# EAGLE design volume board MUSE (EAGLE 6.3)
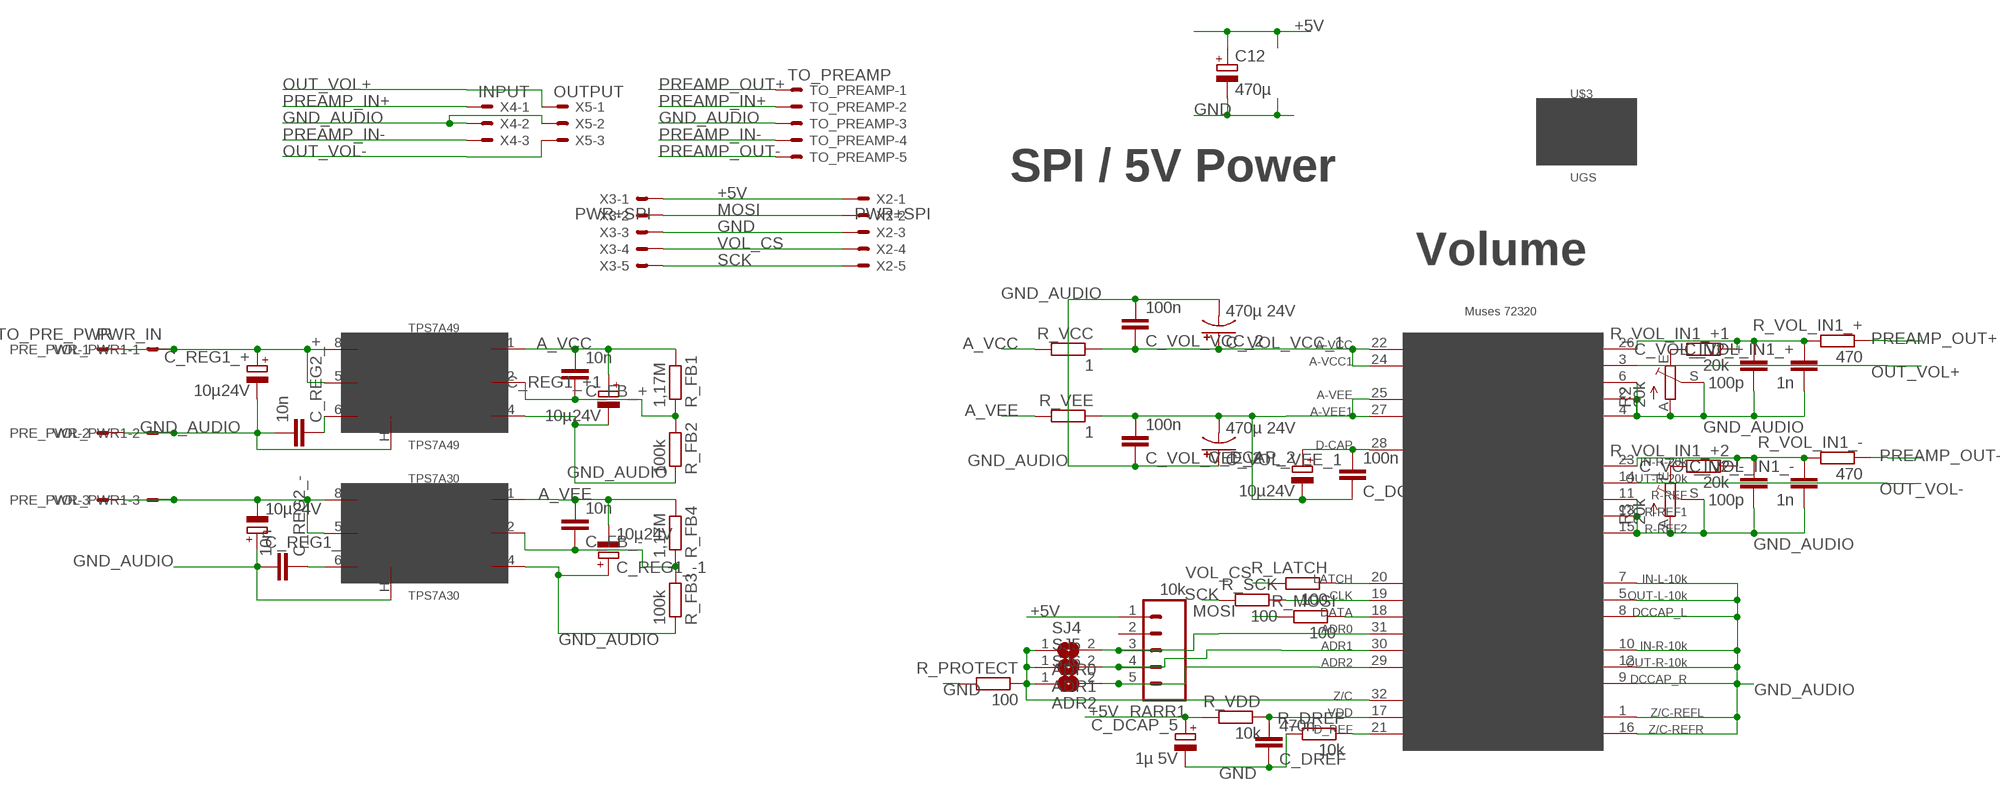
[diagram p0: schematic, sheet 1]

## Parts
C12  470µ  CPOL-EUE2.5-6  [E2,5-6]
C_DCAP_1  100n  C-EUC0603  [C0603]
C_DCAP_2  10µ24V  CPOL-EUC  [PANASONIC_C]
C_DCAP_5  1µ 5V  CPOL-EUE1.8-4  [E1,8-4]
C_DREF  470n  C-EU075-042X103  [C075-042X103]
C_FB_+  10n  C-EUC0603  [C0603]
C_FB_-  10n  C-EUC0603  [C0603]
C_REG1_+  10µ24V  CPOL-EUC  [PANASONIC_C]
C_REG1_+1  10µ24V  CPOL-EUC  [PANASONIC_C]
C_REG1_-  10µ24V  CPOL-EUC  [PANASONIC_C]
C_REG1_-1  10µ24V  CPOL-EUC  [PANASONIC_C]
C_REG2_+  10n  C-EUC0603  [C0603]
C_REG2_-  10n  C-EUC0603  [C0603]
C_VOL_IN1_+  1n  C-EU102-043X133  [C102-043X133]
C_VOL_IN1_-  1n  C-EU102-043X133  [C102-043X133]
C_VOL_IN2_+  100p  C-EU075-032X103  [C075-032X103]
C_VOL_IN2_-  100p  C-EU075-032X103  [C075-032X103]
C_VOL_VCC_1  470µ 24V  CAP_POLH13  [PANASONIC_H13]
C_VOL_VCC_2  100n  C-EUC0603  [C0603]
C_VOL_VEE_1  470µ 24V  CAP_POLH13  [PANASONIC_H13]
C_VOL_VEE_2  100n  C-EUC0603  [C0603]
PRE_PWR  TO_PRE_PWR  C-GRID-03-70543  [70543-03]
R2  20k  TRIM_EU-RJ9W  [RJ9W]
R3  20k  TRIM_EU-RJ9W  [RJ9W]
R_DREF  10k  R-EU_0207/7  [0207/7]
R_FB1  1,17M  R-EU_0207/7  [0207/7]
R_FB2  100k  R-EU_0207/7  [0207/7]
R_FB3  100k  R-EU_0207/7  [0207/7]
R_FB4  1,17M  R-EU_0207/7  [0207/7]
R_LATCH  100  R-EU_0207/7  [0207/7]
R_MOSI  100  R-EU_0207/7  [0207/7]
R_PROTECT  100  R-EU_0207/7  [0207/7]
R_SCK  100  R-EU_0207/7  [0207/7]
R_VCC  1  R-EU_0207/7  [0207/7]
R_VDD  10k  R-EU_0207/7  [0207/7]
R_VEE  1  R-EU_0207/7  [0207/7]
R_VOL_IN1_+  470  R-EU_0207/10  [0207/10]
R_VOL_IN1_+1  20k  R-EU_0207/7  [0207/7]
R_VOL_IN1_+2  20k  R-EU_0207/7  [0207/7]
R_VOL_IN1_-  470  R-EU_0207/10  [0207/10]
RARR1  10k  M05PTH  [1X05]
SJ4  ADR0  SJ  [SJ]
SJ5  ADR1  SJ  [SJ]
SJ6  ADR2  SJ  [SJ]
TO_PREAMP  TO_PREAMP  C-GRID-05-70543  [70543-05]
TPS7A30  TPS7A30  TPS7A49+36V150MA_REG  [MSOP8]
TPS7A49  TPS7A49  TPS7A49+36V150MA_REG  [MSOP8]
U$1  MUSES72320  [SSOP32]
U$3  UGS  [UGS]
VOL_PWR1  PWR_IN  C-GRID-03-70543  [70543-03]
X2  PWR+SPI  C-GRID-05-70543  [70543-05]
X3  PWR+SPI  C-GRID-05-70543  [70543-05]
X4  INPUT  C-GRID-03-70543  [70543-03]
X5  OUTPUT  C-GRID-03-70543  [70543-03]

## Nets
+5V [power]: C12.+ C_DCAP_5.+ R_VDD.2 RARR1.1 X2.1 X3.1
A_VCC [power]: C_FB_+.2 C_REG1_+1.+ R_FB1.2 R_VCC.2 TPS7A49.1(OUT)
A_VEE [power]: C_FB_-.2 C_REG1_-1.- R_FB4.2 R_VEE.2 TPS7A30.1(OUT)
GND [power]: C12.- C_DCAP_5.- C_DREF.1 R_DREF.2 R_PROTECT.2 X2.3 X3.3
GND_AUDIO [power]: C_REG1_+1.- C_REG1_+.- C_REG1_-1.+ C_REG1_-.+ C_REG2_+.2 C_REG2_-.2 C_VOL_IN1_+.2 C_VOL_IN1_-.2 C_VOL_IN2_+.2 C_VOL_IN2_-.2 C_VOL_VCC_1.- C_VOL_VCC_2.2 C_VOL_VEE_1.+ C_VOL_VEE_2.1 PRE_PWR.2 R2.A R2.S R3.A R3.S R_FB2.1 R_FB3.1 TO_PREAMP.3 TPS7A30.4(GND) TPS7A30.H TPS7A49.4(GND) TPS7A49.H U$1.1 U$1.2 U$1.4 U$1.5 U$1.6 U$1.7 U$1.8 U$1.9 U$1.10 U$1.11 U$1.12 U$1.13 U$1.15 U$1.16 VOL_PWR1.2 X4.2 X5.2
JHGCD: R_PROTECT.1 SJ4.1 SJ5.1 SJ6.1 U$1.32
MOSI: R_MOSI.2 X2.2 X3.2
N$1: RARR1.3 SJ4.2 U$1.31
N$2: RARR1.5 SJ6.2 U$1.29
N$5 [power]: C_REG1_-.- PRE_PWR.3 TPS7A30.5(EN) TPS7A30.8(IN) VOL_PWR1.3
N$19: C_VOL_IN1_+.1 C_VOL_IN2_+.1 R_VOL_IN1_+1.1 R_VOL_IN1_+.2 U$1.26
N$27 [power]: C_REG1_+.+ PRE_PWR.1 TPS7A49.5(EN) TPS7A49.8(IN) VOL_PWR1.1
N$37: C_VOL_IN1_-.1 C_VOL_IN2_-.1 R_VOL_IN1_+2.1 R_VOL_IN1_-.2 U$1.23
N$38: R2.E R_VOL_IN1_+1.2
N$39: R3.E R_VOL_IN1_+2.2
N$41 [power]: C_VOL_VCC_1.+ C_VOL_VCC_2.1 R_VCC.1 U$1.22 U$1.24
N$44 [power]: C_DCAP_1.1 C_DCAP_2.- C_VOL_VEE_1.- C_VOL_VEE_2.2 R_VEE.1 U$1.25 U$1.27
N$45: C_DCAP_1.2 C_DCAP_2.+ U$1.28
N$46: R_LATCH.1 U$1.20
N$47: R_SCK.1 U$1.19
N$48: R_MOSI.1 U$1.18
N$50: RARR1.4 SJ5.2 U$1.30
N$53: C_DREF.2 R_VDD.1 U$1.17
N$54: R_DREF.1 U$1.21
N$57: C_FB_+.1 R_FB1.1 R_FB2.2 TPS7A49.2(FB)
N$60: C_FB_-.1 R_FB3.2 R_FB4.1 TPS7A30.2(FB)
N$63: C_REG2_-.1 TPS7A30.6(NR/SS)
N$66: C_REG2_+.1 TPS7A49.6(NR/SS)
OUT_VOL+ [power]: U$1.3 X5.1
OUT_VOL- [power]: U$1.14 X5.3
PREAMP_IN+ [power]: TO_PREAMP.2 X4.1
PREAMP_IN- [power]: TO_PREAMP.4 X4.3
PREAMP_OUT+ [power]: R_VOL_IN1_+.1 TO_PREAMP.1
PREAMP_OUT- [power]: R_VOL_IN1_-.1 TO_PREAMP.5
SCK: R_SCK.2 X2.5 X3.5
VOL_CS: R_LATCH.2 X2.4 X3.4
Unconnected: RARR1.2

## Notes on the sheet
- SPI / 5V Power
- Volume

## Library data of the parts
C12 C_DCAP_2 C_DCAP_5 C_REG1_+ C_REG1_+1 C_REG1_- C_REG1_-1 = rcl:CPOL-EU: POLARIZED CAPACITOR, European symbol
C_DCAP_1 C_DREF C_FB_+ C_FB_- C_REG2_+ C_REG2_- C_VOL_IN1_+ C_VOL_IN1_- C_VOL_IN2_+ C_VOL_IN2_- C_VOL_VCC_2 C_VOL_VEE_2 = rcl:C-EU: CAPACITOR, European symbol
C_VOL_VCC_1 C_VOL_VEE_1 = SparkFun:CAP_POL: Capacitor Polarized These are standard SMD and PTH capacitors. Normally 10uF, 47uF, and 100uF in electrolytic and tantalum varieties. Always verify the external diameter of the through hole cap, it varies with capacity, voltage, and manufacturer. The EIA devices should be standard.
PRE_PWR VOL_PWR1 X4 X5 = con-molex:C-GRID-03: CONNECTOR wire to board 2.54 mm (0.100") pitch header; OC_FARNELL: unknown; OC_NEWARK: unknown
R2 R3 = pot:TRIM_EU-: POTENTIOMETER
R_DREF R_FB1-R_FB4 R_LATCH R_MOSI R_PROTECT R_SCK R_VCC R_VDD R_VEE R_VOL_IN1_+ R_VOL_IN1_+1 R_VOL_IN1_+2 R_VOL_IN1_- = rcl:R-EU_: RESISTOR, European symbol
RARR1 = SparkFun:M05: Header 5 Standard 5-pin 0.1" header. Use with straight break away headers (SKU : PRT-00116), right angle break away headers (PRT-00553), swiss pins (PRT-00743), machine pins (PRT-00117), and female headers (PRT-00115). Molex polarized connector foot print use with SKU : PRT-08230 with associated crimp pins and housings.
SJ4-SJ6 = jumper:SJ: SMD solder JUMPER
TO_PREAMP X2 X3 = con-molex:C-GRID-05: CONNECTOR wire to board 2.54 mm (0.100") pitch header; OC_FARNELL: unknown; OC_NEWARK: unknown
TPS7A30 TPS7A49 = gael:TPS7A49+36V150MA_REG
U$1 = gael:MUSES72320
U$3 = gael:UGS

## Net classes
0 default: width 0.203 mm, clearance 0.203 mm
1 mains: width 0.508 mm, clearance 2.5 mm
2 earth: width 1.27 mm, clearance 0.508 mm
3 main2: width 0.508 mm, clearance 1.5 mm
4 power: width 0.381 mm, clearance 0.203 mm

## Board
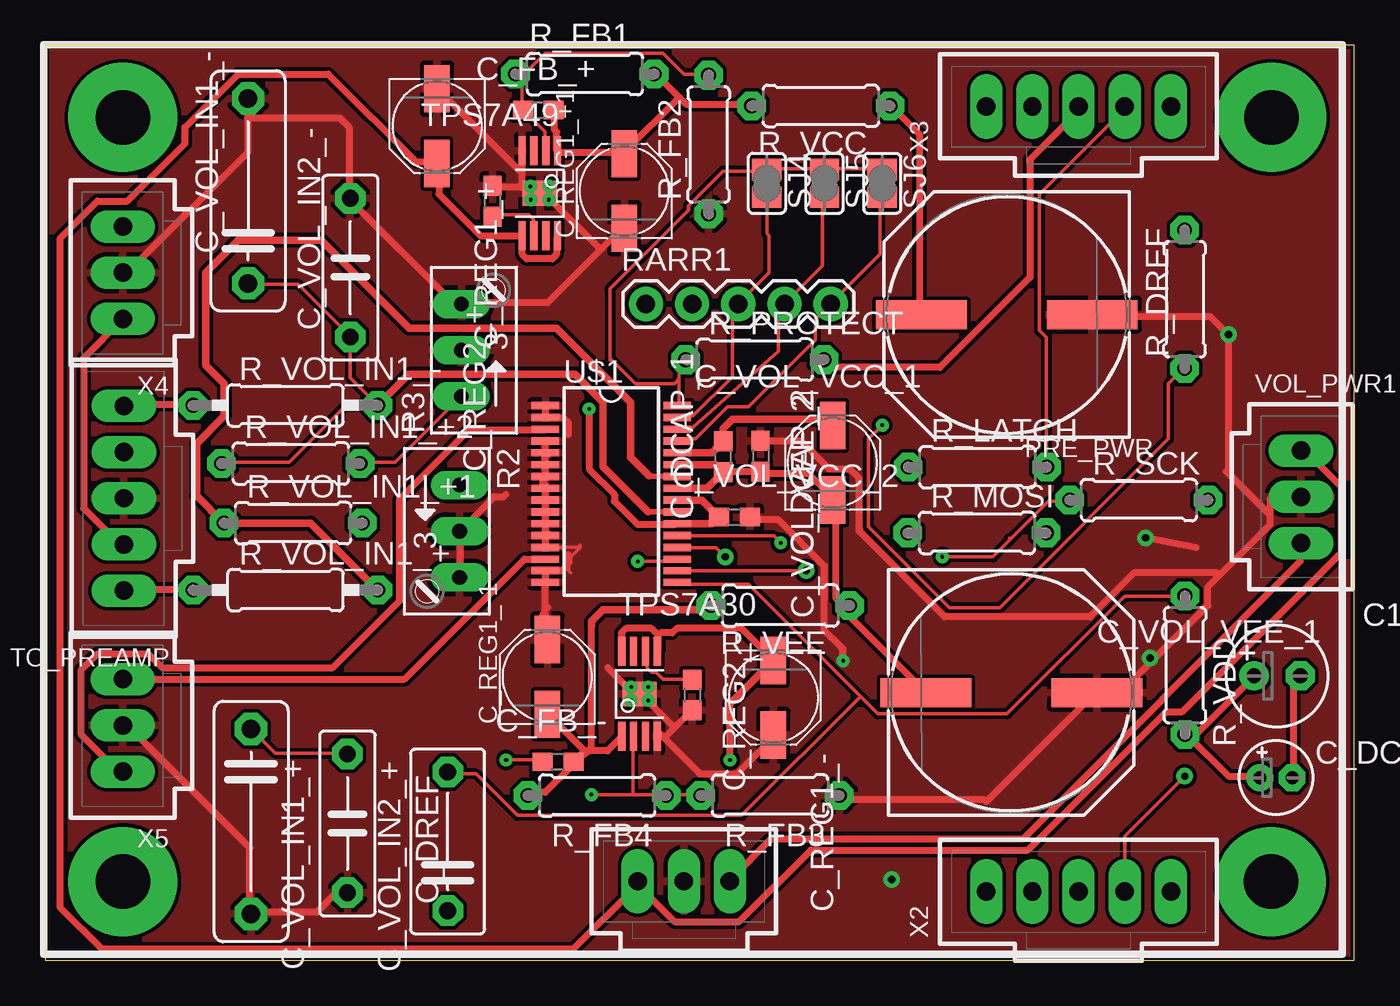
[diagram p1: board, top side]
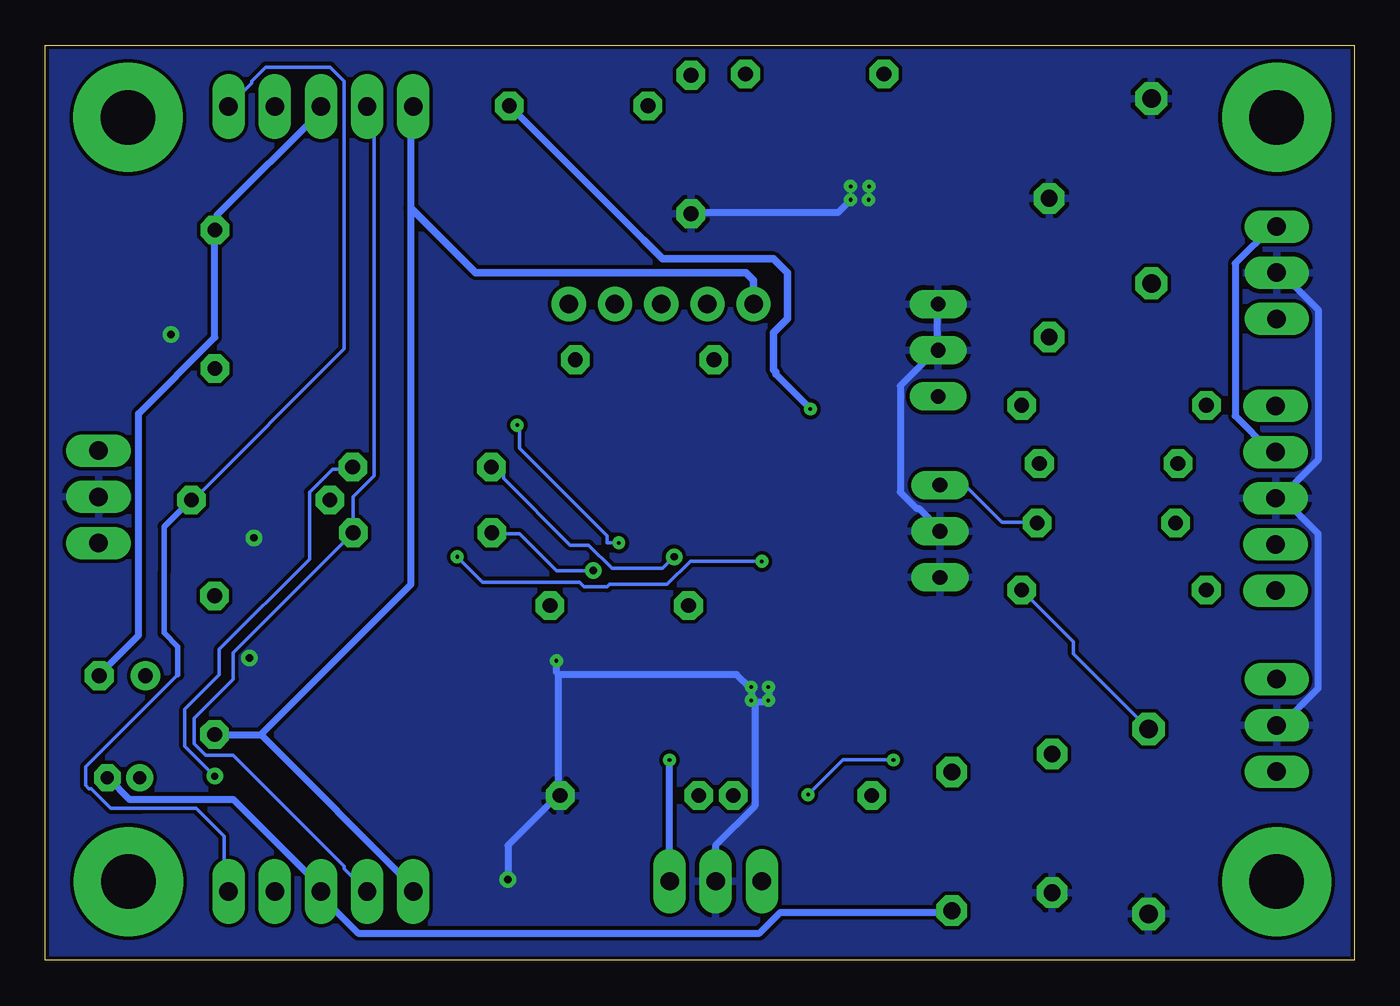
[diagram p2: board, bottom side, seen from below]

Size 71.99 x 50.3 mm. Coordinates in mm from the lower left corner, seen from the top.
Outline: 0,0 71.99,0 71.99,50.3 0,50.3 0,0
Copper layers (1*16): Top 0.035mm / dielectric 1.5mm / Bottom 0.035mm
Design rules "gael design rules": minimum track width 0.2mm, minimum drill 0.2mm, track to track 8mil, track to pad 8mil, pad to pad 8mil, via to via 8mil, smd to smd 8mil, copper to edge 0.2mm, drill to drill 0.2mm, minimum pad ring 15mil, minimum via ring 10mil, stop-mask expansion 4mil, vias tented up to drill 0mil, thermal gap 10mil

### Footprints (pad centres in the part's own frame; a part is rotated, then mirrored left to right if it is on the bottom)
E2,5-6 = drill 0.813 pad 1.6: + -1.27,0 | drill 0.813 pad 1.6 octagon: - 1.27,0
C0603 = smd 1.1 x 1: 1 -0.85,0; 2 0.85,0
PANASONIC_C = smd 2.6 x 1.4: + 2.05,0; - -2.05,0
E1,8-4 = drill 0.711 pad 1.168: + -0.889,0 | drill 0.711 pad 1.168 octagon: - 0.889,0
C075-042X103 = drill 0.914 octagon: 1 -3.81,0; 2 3.81,0
C102-043X133 = drill 1.016 octagon: 1 -5.08,0; 2 5.08,0
C075-032X103 = drill 0.914 octagon: 1 -3.81,0; 2 3.81,0
PANASONIC_H13 = smd 5 x 1.6: + 4.7,0; - -4.7,0
70543-03 = drill 1.016 long: 1 -2.54,0; 2 0,0; 3 2.54,0
RJ9W = drill 0.813 long: A 2.54,0.635; E -2.54,0.635; S 0,0.635
0207/7 = drill 0.813 octagon: 1 -3.81,0; 2 3.81,0
0207/10 = drill 0.813 octagon: 1 -5.08,0; 2 5.08,0
1X05 = drill 1.016 pad 1.88: 1 0,0; 2 2.54,0; 3 5.08,0; 4 7.62,0; 5 10.16,0
SJ = smd 1.168 x 1.6: 1 -0.762,0; 2 0.762,0
70543-05 = drill 1.016 long: 1 -5.08,0; 2 -2.54,0; 3 0,0; 4 2.54,0; 5 5.08,0
MSOP8 = smd 0.4 x 1.6: 1 0.295,-1.065; 2 0.945,-1.065; 3 1.595,-1.065; 4 2.245,-1.065; 5 2.245,3.615; 6 1.595,3.615; 7 0.945,3.615; 8 0.295,3.615 | smd 1.89 x 1.372: H 1.27,1.27
SSOP32 = smd 0.4 x 1.5: 1 0.855,-1.085; 2 1.505,-1.085; 3 2.155,-1.085; 4 2.805,-1.085; 5 3.455,-1.085; 6 4.105,-1.085; 7 4.755,-1.085; 8 5.405,-1.085; 9 6.055,-1.085; 10 6.705,-1.085; 11 7.355,-1.085; 12 8.005,-1.085; 13 8.655,-1.085; 14 9.305,-1.085; 15 9.925,-1.085; 16 10.575,-1.085; 17 10.575,6.165; 18 9.94,6.165; 19 9.305,6.165; 20 8.655,6.165; 21 8.005,6.165; 22 7.355,6.165; 23 6.705,6.165; 24 6.055,6.165; 25 5.405,6.165; 26 4.755,6.165; 27 4.105,6.165; 28 3.455,6.165; 29 2.805,6.165; 30 2.155,6.165; 31 1.505,6.165; 32 0.855,6.165
UGS = drill 3 pad 6: P$1 23.165,-12.497; P$2 23.19,29.54; P$3 -40.005,29.54; P$4 -40.005,-12.497

### Placement (x,y rotation side)
C12  67.76,15.63 0 top
C_DCAP_1  37.29,27.67 90 top
C_DCAP_2  43.3,27.35 90 top
C_DCAP_5  67.69,10.03 0 top
C_DREF  22.13,6.53 90 top
C_FB_+  27.11,46.74 0 top
C_FB_-  28.19,10.9 0 top
C_REG1_+  21.54,45.86 270 top
C_REG1_+1  31.85,42.29 90 top
C_REG1_-  40.04,14.43 270 top
C_REG1_-1  27.61,15.57 90 top
C_REG2_+  24.61,41.72 90 top
C_REG2_-  35.58,14.58 270 top
C_VOL_IN1_+  11.31,7.62 270 top
C_VOL_IN1_-  11.15,42.3 90 top
C_VOL_IN2_+  16.61,7.51 270 top
C_VOL_IN2_-  16.77,38.08 90 top
C_VOL_VCC_1  52.88,35.49 180 top
C_VOL_VCC_2  37.89,24.36 0 top
C_VOL_VEE_1  53.14,14.7 0 top
C_VOL_VEE_2  39.34,27.71 270 top
PRE_PWR  35.12,4.34 0 top
R2  22.14,23.58 270 top
R3  23.51,33.54 90 top
R_DREF  62.67,36.34 90 top
R_FB1  29.67,48.73 0 top
R_FB2  36.48,44.85 90 top
R_FB3  39.86,9.05 180 top
R_FB4  30.34,9.05 180 top
R_LATCH  51.27,27.11 0 top
R_MOSI  51.25,23.5 0 top
R_PROTECT  39.03,33.02 0 top
R_SCK  60.15,25.3 0 top
R_VCC  42.65,46.97 180 top
R_VDD  62.68,16.22 270 top
R_VEE  40.42,19.49 180 top
R_VOL_IN1_+  13.2,20.35 0 top
R_VOL_IN1_+1  13.63,24.03 0 top
R_VOL_IN1_+2  13.5,27.31 0 top
R_VOL_IN1_-  13.2,30.51 0 top
RARR1  33.04,36.08 0 top
SJ4  39.68,42.71 270 top
SJ5  42.86,42.71 270 top
SJ6  46.03,42.71 270 top
TO_PREAMP  4.31,25.4 90 top
TPS7A30  31.41,13.36 0 top
TPS7A49  28.47,43.45 180 top
U$1  28.59,31.35 270 top
U$3  44.26,16.81 0 top
VOL_PWR1  69.07,25.47 270 top
X2  56.83,3.76 0 top
X3  56.83,46.94 0 top
X4  4.25,37.8 90 top
X5  4.25,12.91 90 top

### Tracks (layer width: path | path; a pad name or v marks a point on that pad's centre or on a via)
+5V
  Top 0.381: C_DCAP_5.+ 66.74,10.11 65.09,10.11 62.8,12.4 R_VDD.2 63.18,12.27 66.48,15.58 C12.+
  Bottom 0.381: X2.1 51.75,4.02 60.13,12.4 | 60.13,12.4 62.67,12.4 R_VDD.2 | X3.1 51.88,46.82 51.88,41.36 51.88,36.66 51.88,20.65 60.01,12.53 60.13,12.4
  Bottom 0.406: RARR1.1 33.04,37.37 33.46,37.8 48.32,37.8 51.88,41.36
A_VCC
  Top 0.381: C_FB_+.2 28,46.69 28,45.67 28.13,45.55 28.13,44.53 TPS7A49.1 28.26,44.4 31.81,44.4 C_REG1_+1.+ 31.94,44.53 34.73,47.32 34.86,47.45 | 34.86,47.45 33.59,48.72 R_FB1.2 | 34.86,47.45 35.24,47.07 38.8,47.07 R_VCC.2
A_VEE
  Top 0.381: C_FB_-.2 29.91,11.51 30.92,11.51 31.69,12.27 TPS7A30.1 | C_FB_-.2 29.65,11.51 27.62,13.54 C_REG1_-1.- 27.88,13.04 | 26.48,9.1 R_FB4.2 26.61,9.22 27.5,9.22 29.02,10.75 C_FB_-.2 | 30.04,18.37 30.04,11.64 C_FB_-.2
  Top 0.406: 30.04,18.37 30.04,18.62 30.67,19.26 36.38,19.26 R_VEE.2
  Bottom 0.381: 36.51,19.51 R_VEE.2
GND
  Top 0.381: C_DCAP_5.- 68.64,10.11 68.64,15.19 69.02,15.58 C12.- | X3.3 56.83,46.69 54.17,44.02 54.17,37.55 49.21,32.59 42.86,32.59 42.86,32.72 42.86,32.97 R_PROTECT.2
  Bottom 0.381: X3.3 56.83,46.69 62.55,40.98 62.55,40.21 R_DREF.2 62.67,39.96 62.67,34.24 66.87,30.05 66.87,17.86 69.02,15.7 C12.- | C_DCAP_5.- 68.52,9.99 67.37,8.84 61.66,8.84 56.83,4.02 X2.3 56.96,3.64 54.8,1.48 32.7,1.48 31.56,2.62 22.16,2.62 C_DREF.1
GND_AUDIO  (via drill 0.2, 0.2 pad 0.3, 0.4)
  Top 0.203: U$1.13 29.28,22.69 29.4,22.81 29.4,22.69 28.77,22.05 | 28.77,21.8 28.77,21.42 28.89,21.29 28.64,21.54 28.38,21.54 28.38,21.42
  Top 0.381: 27.5,19 27.5,17.73 C_REG1_-1.+ | 27.5,19 27.5,19.38 | 27.5,19.38 27.5,20.65 U$1.16 27.5,21.42 U$1.15 27.62,21.42 28.38,21.42 | 27.37,19 27.5,19 | U$1.13 27.5,22.81 27.5,23.32 U$1.12 | U$1.12 27.5,23.45 27.5,23.83 U$1.11 27.5,24.08 27.5,24.59 U$1.10 27.5,24.72 27.5,25.23 U$1.9 27.5,25.35 27.5,25.86 U$1.8 27.5,26.12 | U$1.1 27.5,30.43 27.5,29.93 U$1.2 27.62,29.8 28.51,29.8 28.77,29.54 28.77,28.91 | 27.5,26.5 U$1.7 | U$1.7 27.5,26.75 27.5,26.88 27.5,27.13 U$1.6 27.5,27.39 27.5,27.77 U$1.5 | U$1.4 27.5,28.53 27.5,28.02 U$1.5 | 27.62,27.77 U$1.5 | 38.93,24.34 C_VOL_VCC_2.2 39.05,24.21 40.32,24.21 42.86,21.67 42.86,18.11 43.75,17.23 43.88,17.1 v43.88,16.46 | 40.07,12.4 C_REG1_-.+ | 30.92,16.08 32.32,14.69 32.58,14.69 TPS7A30.H | 27.62,19.38 27.5,19.38 | 28.77,22.31 28.77,22.05 28.77,21.8 | 27.62,23.45 U$1.12 | 32.19,14.41 32.19,14.43 32.19,14.56 TPS7A30.H | 33.08,14.94 32.83,14.69 TPS7A30.H | 43.75,9.22 R_FB3.1 43.88,9.1 44.13,8.84 51.63,8.84 51.75,8.72 57.72,14.69 C_VOL_VEE_1.+ 57.98,14.81 59.25,14.81 60.9,16.46 | 67.37,24.59 67.37,23.96 64.58,21.16 | 67.37,24.59 67.37,25.35 VOL_PWR1.2 | 64.58,21.16 63.94,20.53 63.94,19.51 60.9,16.46 | TPS7A49.H 27.11,42.37 TPS7A49.H | X4.2 4.51,37.8 11.11,44.4 11.11,46.31 | 11.11,46.31 11.11,47.32 C_VOL_IN1_-.2 | 11.11,46.31 11.24,46.31 16.19,46.31 16.32,46.18 16.7,45.8 16.7,41.99 C_VOL_IN2_-.2 16.83,41.74 22.29,36.28 R3.A 21.53,36.15 27.62,36.15 30.54,39.07 | 39.94,12.4 C_REG1_-.+ | TPS7A30.4 33.85,12.4 33.97,12.27 | C_VOL_IN2_+.2 15.94,3.64 14.92,2.62 11.37,2.62 C_VOL_IN1_+.2 11.24,2.75 11.24,6.18 4.51,12.91 X5.2 | 30.54,39.07 31.69,40.21 C_REG1_+1.-
  Top 0.381: v26.71,41.81 26.73,41.86 27.11,42.24 TPS7A49.H | TPS7A49.H 27.37,42.12 27.62,41.86 v27.7,41.81 27.88,41.74 30.42,39.2 30.54,39.07 | v27.7,42.55 27.62,42.5 27.5,42.37 TPS7A49.H | 63.31,22.69 v60.52,23.22 | 67.37,24.59 67.25,24.59 64.96,26.88 65.09,27 65.09,34.37 v65.09,34.4 64.96,34.5 64.07,35.39 57.59,35.39 C_VOL_VCC_1.- | v32.22,14.28 32.19,14.3 TPS7A30.H | 33.97,12.27 36,10.24 38.04,10.24 39.81,12.02 39.81,12.27 C_REG1_-.+ | 34.61,12.78 34.1,12.27 33.97,12.27 | 34.61,12.78 35.5,13.67 C_REG2_-.2 | C_VOL_VEE_2.1 39.43,28.53 41.59,28.53 43.12,27 44.26,27 44.77,26.5 44.77,23.58 49.47,18.88 57.47,18.88 59.88,21.29 64.45,21.29 64.58,21.16 | 34.61,12.78 34.48,12.91 33.21,14.18 TPS7A30.H | v60.77,16.62 60.77,16.59 60.9,16.46 | U$1.7 27.5,26.62 27.37,26.62 | 25.34,25.61 25.21,25.48 24.7,25.48 22.8,23.58 R2.S 22.8,23.45 22.8,21.16 R2.A | 26.23,42.5 26.99,42.5 TPS7A49.H | 26.23,42.5 24.7,42.5 C_REG2_+.2 | 26.23,43.39 26.23,42.63 26.23,42.5 | 26.23,43.39 26.23,44.4 TPS7A49.4 | C_REG1_+.- 21.65,47.83 26.1,43.39 26.23,43.39
  Top 0.406: TPS7A49.H 27.24,42.24 27.34,42.31 | 27.37,26.12 27.37,26.37 | 27.5,26.12 27.37,26.12 | 27.37,26.12 27.37,26.37 | 27.37,26.37 27.37,26.62 27.37,26.37
  Bottom 0.381: 43.75,15.7 43.75,9.1 R_FB3.1 43.88,8.97 46.55,6.3 46.55,4.53 v46.55,4.42 | X4.2 4,37.8 1.97,35.77 1.97,27.51 4,25.48 4.25,25.48 TO_PREAMP.3 3.87,25.35 1.97,23.45 1.97,14.94 4,12.91 X5.2 | 33.21,14.94 33.97,15.7 43.62,15.7 43.75,15.7 | 33.21,14.94 33.16,14.86 | v32.22,15.02 32.19,14.94 32.19,14.3 v32.22,14.28 32.32,14.18 33.08,14.18 v33.16,14.28 32.96,14.05 32.96,8.46 35.12,6.3 35.12,4.4 PRE_PWR.2 | 33.21,14.94 v33.16,15.02 | v43.88,16.46 43.88,15.83 43.75,15.7 | R3.A 22.92,36.02 22.92,33.61 R3.S 23.05,33.48 24.96,31.58 24.96,25.73 24.07,24.85 23.94,24.85 22.8,23.7 R2.S | R_FB2.1 36.39,41.1 28.38,41.1 27.75,41.74 v27.7,41.81
  Bottom 0.406: v33.16,15.02 v33.16,14.28
  other vias: 26.68,42.55
  pour Top: 71.69,50.5 -0.07,50.5 -0.07,0.21 71.69,0.21
  pour Bottom: 71.82,50.5 -0.13,50.5 -0.13,0.21 71.82,0.21
JHGCD
  Top 0.203: 34.86,31.96 34.86,32.21 35.12,32.47 R_PROTECT.1 | 34.86,31.96 34.86,30.56 U$1.32 | SJ6.1 45.91,43.52 42.86,43.52 SJ5.1 42.74,43.52 39.69,43.52 SJ4.1 39.56,43.39 37.27,43.39 35.37,41.48 35.37,41.23 31.43,37.29 31.05,36.91 31.05,32.97 31.18,32.97 32.45,31.7 34.61,31.7 34.86,31.96
  Bottom 0.203: 35.12,32.97 R_PROTECT.1
MOSI
  Bottom 0.203: X3.2 53.91,46.56 53.91,26.62 55.05,25.48 55.05,23.58 R_MOSI.2 | X2.2 55.56,5.03 55.56,5.16 61.66,11.26 63.18,11.26 63.82,11.89 63.82,13.29 61.66,15.45 61.66,16.9 R_MOSI.2 | 55.18,23.45 R_MOSI.2
N$1
  Top 0.203: U$1.31 34.86,29.93 35.62,29.93 37.78,32.09 37.78,33.74 37.78,35.75 RARR1.3 38.16,36.15 39.81,37.8 39.81,39.83 39.69,39.96 39.69,41.86 SJ4.2 39.56,41.86
N$2
  Top 0.203: U$1.29 34.86,28.66 35.75,28.66 37.53,30.43 38.67,30.43 42.35,34.12 42.35,35.24 RARR1.5 43.24,36.15 45.91,38.82 45.91,41.86 | 45.91,41.86 SJ6.2 45.91,41.86
N$5  (via drill 0.2)
  Top 0.381: 33.72,17.86 33.34,18.24 31.94,18.24 31.69,17.99 31.69,17.1 TPS7A30.8 | 33.72,17.86 33.72,17.1 TPS7A30.5 | 33.72,17.86 33.85,17.99 34.48,17.99 34.73,18.24 38.29,18.24 39.94,16.59 C_REG1_-.- 39.56,16.72 | VOL_PWR1.3 69.02,22.81 69.02,21.92 53.78,6.69 39.94,6.69 39.81,6.56 37.78,4.53 PRE_PWR.3 37.66,4.4 | v37.66,11 37.66,13.92 37.66,14.09
  Top 0.406: 37.66,14.09 C_REG1_-.-
  Bottom 0.381: 37.66,4.4 PRE_PWR.3 37.66,4.53 v37.66,11
N$19
  Top 0.203: 16.07,11.38 C_VOL_IN2_+.1 | 16.07,11.38 C_VOL_IN2_+.1 | 16.07,11.38 12.64,11.38 11.37,12.65 C_VOL_IN1_+.1 | 16.07,11.38 C_VOL_IN2_+.1 | 18.22,20.27 R_VOL_IN1_+.2 | 33.24,26.59 33.21,26.62
  Top 0.305: 33.24,26.59 U$1.26
  Top 0.406: 33.21,26.62 32.19,27.64 32.19,30.69 28.13,34.75 20,34.75 15.18,39.58 10.6,39.58 8.83,37.8 8.83,32.72 9.84,31.7 9.84,29.93 8.32,28.4 8.32,25.53 R_VOL_IN1_+1.1 14.6,24.03 R_VOL_IN1_+.2
  Bottom 0.203: C_VOL_IN1_+.1 11.37,12.78 15.43,16.84 15.43,17.5 R_VOL_IN1_+.2
N$27
  Top 0.381: VOL_PWR1.1 69.15,27.89 69.41,27.89 71.31,25.99 71.31,22.43 62.55,13.67 61.66,13.67 54.04,6.05 42.1,6.05 38.16,2.11 34.61,2.11 32.58,4.14 32.58,4.27 PRE_PWR.1 32.45,4.02 29.02,0.59 3.11,0.59 0.83,2.88 0.83,39.7 2.86,41.74 4.51,41.74 7.68,44.91 7.68,45.8 10.6,48.72 15.56,48.72 20.38,43.9 21.4,43.9 C_REG1_+.+ 21.65,43.77 21.65,42.12 23.94,39.83 26.1,39.83 TPS7A49.5 26.23,39.7 26.23,38.82 26.48,38.56 27.88,38.56 28,38.69 28.13,38.82 28.13,39.7 TPS7A49.8
N$37
  Top 0.203: R_VOL_IN1_+2.1 9.72,27.39 13.4,27.39 16.45,30.43 R_VOL_IN1_-.2 16.77,32.02 C_VOL_IN2_-.1 16.7,34.37 13.91,37.16 11.24,37.16 C_VOL_IN1_-.1
  Top 0.305: 33.16,24.64 U$1.23
  Top 0.406: 33.16,24.64 30.67,27.13 30.67,30.69 29.15,32.21 19.99,32.21 R_VOL_IN1_-.2
N$38
  Bottom 0.203: R_VOL_IN1_+1.2 17.46,24.08 19.37,24.08 21.4,26.12 22.67,26.12 R2.E
N$39
  Top 0.203: R_VOL_IN1_+2.2 17.34,27.39 19.24,27.39 22.8,30.94 R3.E
N$41  (via drill 0.2)
  Top 0.381: C_VOL_VCC_1.+ 48.07,35.51 48.07,45.42 46.55,46.94 R_VCC.1 | U$1.22 34.61,23.96 32.58,23.96 31.43,25.1 31.31,25.23 31.31,25.61 29.91,27 v29.91,30.31
  Top 0.406: U$1.24 36.11,25.29 C_VOL_VCC_2.1 36.68,23.99 U$1.22
  Bottom 0.381: R_VCC.1 46.42,46.94 39.31,39.83 39.18,39.7 39.05,39.58 | 31.81,32.21 v29.91,30.31
  Bottom 0.406: 31.81,32.21 31.81,32.34 31.94,32.47 31.94,34.5 31.18,35.26 31.18,37.8 31.94,38.56 38.04,38.56 39.05,39.58
N$44
  Top 0.381: C_DCAP_1.1 37.66,26.88 39.31,26.88 C_VOL_VEE_2.2 39.43,26.75 41.97,26.75 43.12,25.61 C_DCAP_2.- 43.5,25.23 43.5,19.89 44.13,19.26 R_VEE.1 44.01,19.13 48.32,14.81 C_VOL_VEE_1.-
  Top 0.406: U$1.27 36.87,27.24 C_DCAP_1.1 | U$1.25 36.41,25.94 C_DCAP_1.1 | C_DCAP_1.1 37.55,26.82 | C_DCAP_2.- 43.3,25.55
N$45
  Top 0.406: U$1.28 36.66,27.89 C_DCAP_1.2 37.29,29.23 37.81,29.75 42.96,29.75 C_DCAP_2.+
N$46  (via drill 0.4)
  Top 0.203: v37.4,22.18 36.89,22.69 34.86,22.69 U$1.20
  Bottom 0.203: v37.4,22.18 38.04,21.54 40.83,21.54 42.1,22.81 43.12,22.81 46.8,26.5 46.8,27 | 46.8,27 47.43,27 R_LATCH.1 46.8,27
N$47  (via drill 0.2)
  Top 0.203: v32.58,21.92 34.73,21.92 U$1.19 | R_SCK.1 56.32,25.23 55.18,25.23 53.09,23.13 | v49.34,22.18 52.13,22.18 53.09,23.13 | 53.02,23.19 53.09,23.13
  Bottom 0.203: v32.58,21.92 36,21.92 36.51,21.92 37.78,20.65 40.96,20.65 41.08,20.53 42.35,20.53 42.61,20.78 47.94,20.78 v49.34,22.18
N$48  (via drill 0.4)
  Top 0.203: v41.85,21.42 34.86,21.42 U$1.18
  Bottom 0.203: v41.85,21.42 43.88,21.42 45.91,23.45 47.43,23.45 | 47.43,23.45 R_MOSI.1 47.43,23.45
N$50
  Top 0.203: U$1.30 34.86,29.29 35.62,29.29 40.12,33.3 40.32,33.48 40.32,35.75 RARR1.4 40.7,36.15 42.74,38.18 42.74,41.86 | 42.74,41.86 SJ5.2 42.74,41.86
N$53
  Top 0.203: 44.83,14.5 45.78,13.54 52.9,13.54 59.37,20.02 62.67,20.02 R_VDD.1 | 44.83,14.5 38.67,20.65 34.86,20.65 U$1.17 | C_DREF.2 22.16,10.24 23.69,10.24 25.97,7.96 38.29,7.96 44.77,14.43 44.83,14.5
N$54  (via drill 0.2)
  Top 0.203: v40.45,22.94 40.07,23.32 34.86,23.32 U$1.21 | R_DREF.1 62.55,32.47 61.79,31.7 61.79,28.66 52.51,19.38 49.72,19.38 45.28,23.83 45.28,24.34 45.28,28.66 v46.04,29.42
  Bottom 0.203: v40.45,22.94 41.08,22.94 41.08,23.32 45.91,28.15 45.91,29.29 v46.04,29.42
N$57
  Top 0.203: R_FB1.1 25.97,48.72 26.23,48.47 26.23,46.82 C_FB_+.1 26.35,46.69 27.5,45.55 27.5,44.53 TPS7A49.2 | R_FB2.2 36.39,48.72 35.12,48.72 33.97,49.86 27.5,49.86 26.23,48.59 | 26.23,48.59 R_FB1.1 | 26.23,48.59 R_FB1.1
N$60  (via drill 0.2)
  Top 0.203: 32.32,9.1 33.97,9.1 R_FB4.1 34.1,9.1 36,9.1 R_FB3.2 | 32.32,9.1 v30.04,9.1 | 32.32,9.1 32.32,12.27 TPS7A30.2 | v25.34,11 27.24,11 C_FB_-.1
  Bottom 0.203: v25.34,11 28.13,11 v30.04,9.1
N$63
  Top 0.203: C_REG2_-.1 35.5,15.45 33.97,15.45 33.59,15.83 33.34,15.83 33.08,16.08 33.08,16.97 TPS7A30.6
N$66
  Top 0.203: C_REG2_+.1 24.7,40.98 26.61,40.98 26.86,40.72 26.86,39.83 TPS7A49.6
OUT_VOL+
  Top 0.381: X5.1 4,10.37 1.97,12.4 1.97,15.96 2.86,16.84 5.65,16.84 6.41,16.08 15.81,16.08 19.49,19.77 19.49,25.35 23.3,29.16 27.5,29.16 U$1.3
OUT_VOL-
  Top 0.381: U$1.14 27.37,22.05 26.35,22.05 19.75,15.45 X5.3
PREAMP_IN+
  Top 0.381: X4.1 2.1,33.1 2.1,24.85 4,22.94 4.25,22.94 TO_PREAMP.2
PREAMP_IN-
  Bottom 0.381: X4.3 4.51,40.34 6.54,38.31 6.54,29.93 4.64,28.02 4.38,28.02 TO_PREAMP.4
PREAMP_OUT+
  Top 0.381: R_VOL_IN1_+.1 8.83,20.4 4.38,20.4 TO_PREAMP.1
PREAMP_OUT-
  Top 0.381: R_VOL_IN1_-.1 8.83,30.56 4.38,30.56 TO_PREAMP.5
SCK
  Bottom 0.203: X2.5 62.17,3.76 62.17,6.81 63.69,8.34 66.74,8.34 68.39,8.34 69.47,9.42 69.6,9.42 69.79,9.61 69.79,10.62 64.71,15.7 | 64.07,25.23 R_SCK.2 63.82,25.35 55.56,33.61 55.56,48.34 56.32,49.1 59.88,49.1 60.64,48.34 60.64,48.21 X3.5
  Bottom 0.305: R_SCK.2 64.2,25.1 65.47,23.83 65.47,21.29 65.47,17.99 64.71,17.23 64.71,15.7
VOL_CS  (via drill 0.4)
  Top 0.203: X3.4 59.37,46.82 54.67,42.12 54.67,34.62 55.05,34.24 55.05,27.13 R_LATCH.2 | X2.4 59.37,6.81 v62.67,10.11
  Bottom 0.203: v62.67,10.11 64.33,11.77 64.33,13.8 62.42,15.7 62.42,17.1 57.47,22.05 57.47,25.73 56.2,27 55.18,27 R_LATCH.2

### Text on the board
tValues: 1. +5V / 2. MOSI / 3. GND / 4. CS / 5. SCK